# Altium schematic sheet PHY6222(20211015)（无电感）新.SCHDOC
size A4
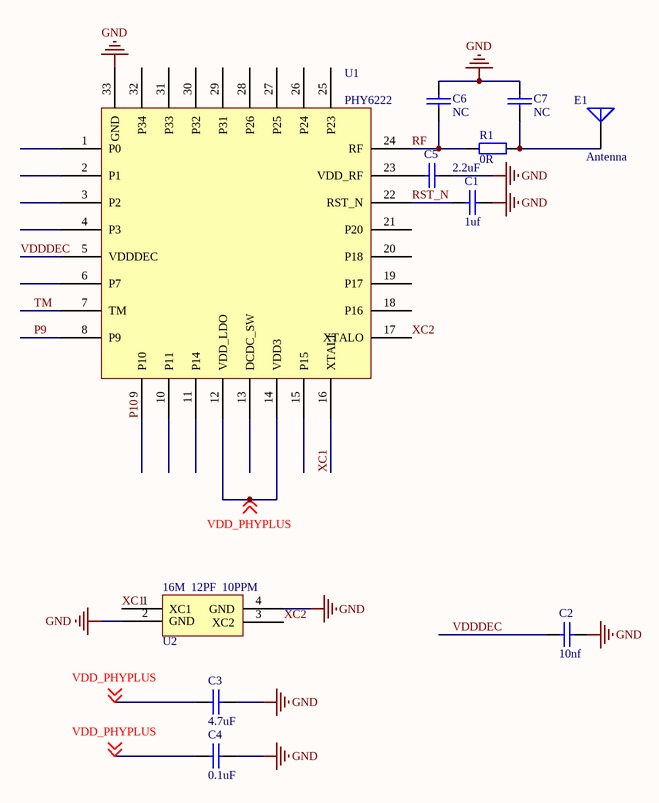
[diagram p0: PHY6222(20211015)（无电感）新.SCHDOC]

## Parts
16M_12PF_10PPM  U2  [3225]
C1  1uf  [C0603]
C2  10nf  [C0603]
C3  4.7uF  [C0603]
C4  0.1uF  [C0603]
C5  2.2uF  [C0603]
C6  NC  [C0603]
C7  NC  [C0603]
E1  Antenna  [PIN1]
R1  0R  [AXIAL-0.4]
U1  PHY6222

## Nets
GND: 16M_12PF_10PPM.2(GND) 16M_12PF_10PPM.4(GND) C1.1 C2.2 C3.2 C4.2 C5.2 C6.2 C7.2 U1.33(GND)
P9: U1.8(P9)
P10: U1.9(P10)
RF: C6.1 R1.2 U1.24(RF)
RST_N: C1.2 U1.22(RST_N)
TM: U1.7(TM)
VDD_PHYPLUS: C3.1 C4.1 U1.12(VDD_LDO) U1.14(VDD3) ; off-sheet VDD_PHYPLUS
VDDDEC: C2.1 U1.5(VDDDEC)
XC1: 16M_12PF_10PPM.1(XC1) U1.16(XTALI)
XC2: 16M_12PF_10PPM.3(XC2) U1.17(XTALO)
NetC5_1: C5.1 U1.23(VDD_RF)
NetC7_1: C7.1 E1.1(A) R1.1

Not connected (* = marked no-connect by the designer): U1 1(P0) 2(P1) 3(P2) 4(P3) 6(P7) 10(P11) 11(P14) 13(DCDC_SW) 15(P15) 18(P16) 19(P17) 20(P18) 21(P20) 25(P23) 26(P24) 27(P25) 28(P26) 29(P31) 30(P32) 31(P33) 32(P34)

## Library data of the parts
16M_12PF_10PPM = 3225
C1-C7 = 든휭능튬
E1 = Antenna: Generic Antenna; Published: 24-Mar-1999; LatestRevisionDate: 17-Jul-2002; LatestRevisionNote: Re-released for DXP Platform.; PackageReference: PIN1; Publisher: Altium Limited
R1 = Res2: Resistor; Value: 1K; Published: 8-Jun-2000; LatestRevisionDate: 17-Jul-2002; LatestRevisionNote: Re-released for DXP Platform.; PackageReference: AXIAL-0.4; Publisher: Altium Limited
U1 = QFN32-1202